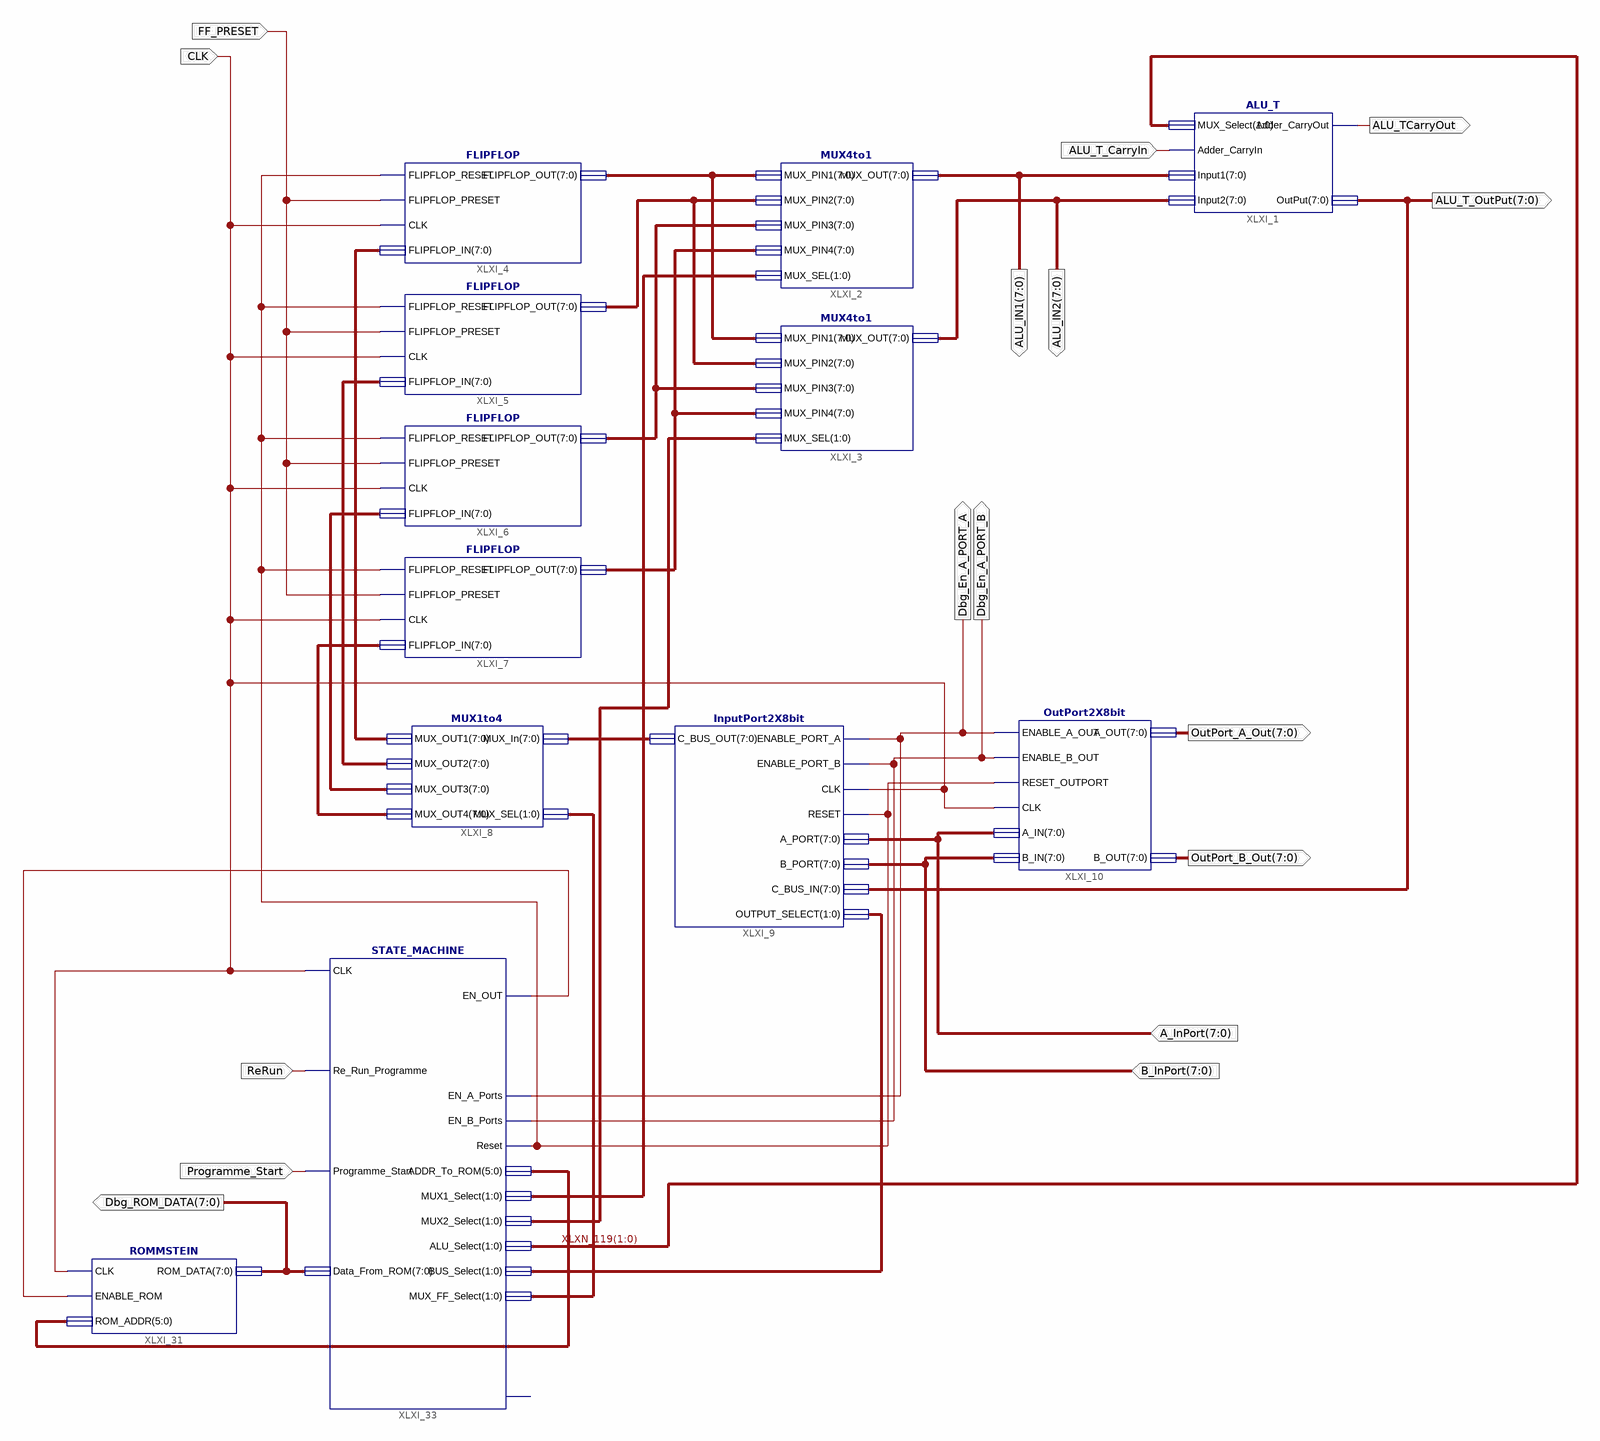
[diagram p0: schematic sheet 1]
// Xilinx ISE schematic MC.sch (spartan3e) as structural Verilog: 12 symbols, 16 ports
module MC (
  input  ALU_T_CarryIn,
  input  CLK,
  input  FF_PRESET,
  input  Programme_Start,
  input  ReRun,
  input  [7:0] A_InPort,
  input  [7:0] B_InPort,
  output [7:0] ALU_IN1,
  output [7:0] ALU_IN2,
  output ALU_TCarryOut,
  output [7:0] ALU_T_OutPut,
  output [7:0] OutPort_A_Out,
  output [7:0] OutPort_B_Out,
  output Dbg_En_A_PORT_A,
  output Dbg_En_A_PORT_B,
  output [7:0] Dbg_ROM_DATA
);

  wire XLXN_94, XLXN_104;
  wire [1:0] XLXN_95, XLXN_96, XLXN_97, XLXN_105, XLXN_119;
  wire [5:0] XLXN_117;
  wire [7:0] XLXN_7, XLXN_8, XLXN_9, XLXN_10, XLXN_21, XLXN_22, XLXN_23, XLXN_24, XLXN_28;

  ALU_T XLXI_1 (
    .MUX_Select(XLXN_119), .Adder_CarryIn(ALU_T_CarryIn), .Input1(ALU_IN1), .Input2(ALU_IN2),
    .Adder_CarryOut(ALU_TCarryOut), .OutPut(ALU_T_OutPut));
  MUX4to1 XLXI_2 (
    .MUX_PIN1(XLXN_7), .MUX_PIN2(XLXN_8), .MUX_PIN3(XLXN_9), .MUX_PIN4(XLXN_10), .MUX_SEL(XLXN_96),
    .MUX_OUT(ALU_IN1));
  MUX4to1 XLXI_3 (
    .MUX_PIN1(XLXN_7), .MUX_PIN2(XLXN_8), .MUX_PIN3(XLXN_9), .MUX_PIN4(XLXN_10), .MUX_SEL(XLXN_97),
    .MUX_OUT(ALU_IN2));
  FLIPFLOP XLXI_4 (
    .FLIPFLOP_RESET(XLXN_94), .FLIPFLOP_PRESET(FF_PRESET), .CLK(CLK), .FLIPFLOP_IN(XLXN_21),
    .FLIPFLOP_OUT(XLXN_7));
  FLIPFLOP XLXI_5 (
    .FLIPFLOP_RESET(XLXN_94), .FLIPFLOP_PRESET(FF_PRESET), .CLK(CLK), .FLIPFLOP_IN(XLXN_22),
    .FLIPFLOP_OUT(XLXN_8));
  FLIPFLOP XLXI_6 (
    .FLIPFLOP_RESET(XLXN_94), .FLIPFLOP_PRESET(FF_PRESET), .CLK(CLK), .FLIPFLOP_IN(XLXN_23),
    .FLIPFLOP_OUT(XLXN_9));
  FLIPFLOP XLXI_7 (
    .FLIPFLOP_RESET(XLXN_94), .FLIPFLOP_PRESET(FF_PRESET), .CLK(CLK), .FLIPFLOP_IN(XLXN_24),
    .FLIPFLOP_OUT(XLXN_10));
  MUX1to4 XLXI_8 (
    .MUX_In(XLXN_28), .MUX_SEL(XLXN_95), .MUX_OUT1(XLXN_21), .MUX_OUT2(XLXN_22), .MUX_OUT3(XLXN_23),
    .MUX_OUT4(XLXN_24));
  InputPort2X8bit XLXI_9 (
    .ENABLE_PORT_A(Dbg_En_A_PORT_A), .ENABLE_PORT_B(Dbg_En_A_PORT_B), .CLK(CLK), .RESET(XLXN_94),
    .A_PORT(A_InPort), .B_PORT(B_InPort), .C_BUS_IN(ALU_T_OutPut), .OUTPUT_SELECT(XLXN_105),
    .C_BUS_OUT(XLXN_28));
  OutPort2X8bit XLXI_10 (
    .ENABLE_A_OUT(Dbg_En_A_PORT_A), .ENABLE_B_OUT(Dbg_En_A_PORT_B), .RESET_OUTPORT(XLXN_94), .CLK(CLK),
    .A_IN(A_InPort), .B_IN(B_InPort), .A_OUT(OutPort_A_Out), .B_OUT(OutPort_B_Out));
  ROMMSTEIN XLXI_31 (.CLK(CLK), .ENABLE_ROM(XLXN_104), .ROM_ADDR(XLXN_117), .ROM_DATA(Dbg_ROM_DATA));
  STATE_MACHINE XLXI_33 (
    .CLK(CLK), .Re_Run_Programme(ReRun), .Programme_Start(Programme_Start), .Data_From_ROM(Dbg_ROM_DATA),
    .EN_OUT(XLXN_104), .EN_A_Ports(Dbg_En_A_PORT_A), .EN_B_Ports(Dbg_En_A_PORT_B), .Reset(XLXN_94),
    .ADDR_To_ROM(XLXN_117), .MUX_FF_Select(XLXN_95), .MUX1_Select(XLXN_96), .MUX2_Select(XLXN_97),
    .ALU_Select(XLXN_119), .BUS_Select(XLXN_105));  // open: Programme_Status
endmodule
